# Altium schematic sheet Sheet1.SchDoc
size A4
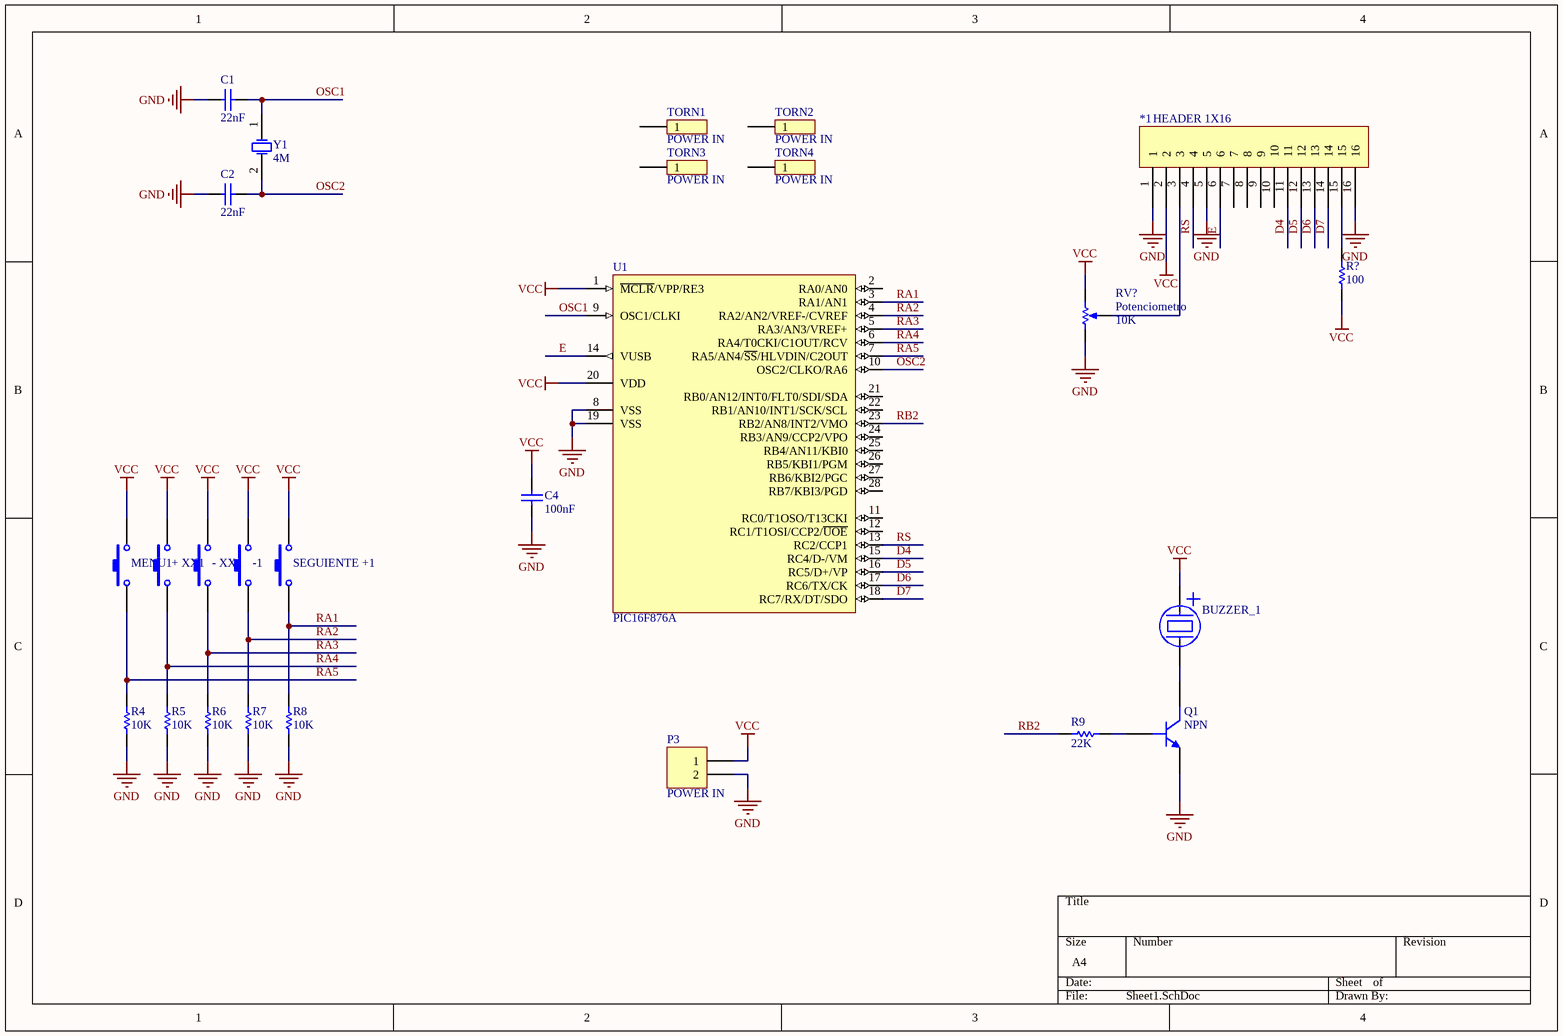
[diagram p0: Sheet1.SchDoc]

## Parts
*1  HEADER 1X16  [DISPLAY LCD 16x2]
+_XX1  PULSADOR  [PULSADOR4_ALTO]  (value not drawn)
-1  PULSADOR  [PULSADOR4_ALTO]  (value not drawn)
-_XX1  PULSADOR  [PULSADOR4_ALTO]  (value not drawn)
?  BUZZER_1  [Buzzer]
C1  value 22nF  [1206_Cap]  (hidden comment: Comment)
C2  value 22nF  [1206_Cap]  (hidden comment: Comment)
C4  value 100nF  [1206_Cap]  (hidden comment: Comment)
MENU1  PULSADOR  [PULSADOR4_ALTO]  (value not drawn)
P3  POWER IN  [BORNERA2 azul]
Q1  NPN  [TO92]
R4  value 10K  [1206]  (hidden comment: Comment)
R5  value 10K  [1206]  (hidden comment: Comment)
R6  value 10K  [1206]  (hidden comment: Comment)
R7  value 10K  [1206]  (hidden comment: Comment)
R8  value 10K  [1206]  (hidden comment: Comment)
R9  value 22K  [1206]  (hidden comment: Comment)
R?  value 100  [1206]  (hidden comment: Comment)
RV?  Potenciometro  value 10K  [PRESET VERTICAL]
SEGUIENTE_+1  PULSADOR  [PULSADOR4_ALTO]  (value not drawn)
TORN1  POWER IN  [TORNILLO]
TORN2  POWER IN  [TORNILLO]
TORN3  POWER IN  [TORNILLO]
TORN4  POWER IN  [TORNILLO]
U1  PIC16F876A  [DIP28]
Y1  4M  [CRISTAL]

## Nets
GND: *1.1 *1.5 *1.16 C1.1 C2.1 C4.1 P3.2 Q1.1(E) R4.2 R5.2 R6.2 R7.2 R8.2 RV?.1(TOP) U1.8(VSS) U1.19(VSS)
VCC: *1.2 +_XX1.2 -1.2 -_XX1.2 ?.1 C4.2 MENU1.2 P3.1 R?.2 RV?.2(BOT) SEGUIENTE_+1.2 U1.1(~{MCLR}/VPP/RE3) U1.20(VDD)
D4: *1.11 U1.15(RC4/D-/VM)
D5: *1.12 U1.16(RC5/D+/VP)
D6: *1.13 U1.17(RC6/TX/CK)
D7: *1.14 U1.18(RC7/RX/DT/SDO)
E: *1.6 U1.14(VUSB)
OSC1: C1.2 U1.9(OSC1/CLKI) Y1.1(OSC1)
OSC2: C2.2 U1.10(OSC2/CLKO/RA6) Y1.2(OSC2)
RA1: R8.1 SEGUIENTE_+1.1 U1.3(RA1/AN1)
RA2: -1.1 R7.1 U1.4(RA2/AN2/VREF-/CVREF)
RA3: -_XX1.1 R6.1 U1.5(RA3/AN3/VREF+)
RA4: +_XX1.1 R5.1 U1.6(RA4/T0CKI/C1OUT/RCV)
RA5: MENU1.1 R4.1 U1.7(RA5/AN4/~{SS}/HLVDIN/C2OUT)
RB2: R9.1 U1.23(RB2/AN8/INT2/VMO)
RS: *1.4 U1.13(RC2/CCP1)
Net*1_3: *1.3 RV?.3(TAP)
Net*1_15: *1.15 R?.1
Net?_2: ?.2 Q1.3(C)
NetQ1_2: Q1.2(B) R9.2

Not connected (* = marked no-connect by the designer): *1 7 8 9 10; TORN1 1; TORN2 1; TORN3 1; TORN4 1; U1 2(RA0/AN0) 11(RC0/T1OSO/T13CKI) 12(RC1/T1OSI/CCP2/~{UOE}) 21(RB0/AN12/INT0/FLT0/SDI/SDA) 22(RB1/AN10/INT1/SCK/SCL) 24(RB3/AN9/CCP2/VPO) 25(RB4/AN11/KBI0) 26(RB5/KBI1/PGM) 27(RB6/KBI2/PGC) 28(RB7/KBI3/PGD)

## Library data of the parts
+_XX1 -1 -_XX1 MENU1 SEGUIENTE_+1 = PULSADOR: Switch; Published: 24-Mar-1999; LatestRevisionDate: 17-Jul-2002; LatestRevisionNote: Re-released for DXP Platform.; PackageReference: SPST-2; Publisher: Altium Limited
C1 C2 C4 = Cap Semi: Capacitor (Semiconductor SIM Model); Published: 8-Jun-2000; LatestRevisionDate: 17-Jul-2002; LatestRevisionNote: Re-released for DXP Platform.; PackageReference: C1206; Publisher: Altium Limited
P3 = Header 2: Header, 2-Pin; LatestRevisionDate: 17-Jul-2002; LatestRevisionNote: Re-released for DXP Platform.; Publisher: Altium Limited
Q1 = NPN: PNP Bipolar Transistor; Published: 8-Jun-2000; LatestRevisionDate: 17-Jul-2002; LatestRevisionNote: Re-released for DXP Platform.; PackageReference: SOT-23B; Publisher: Altium Limited; Code_JEDEC: SOT-23
R4-R9 R? = Res Semi: Semiconductor Resistor; Published: 8-Jun-2000; LatestRevisionDate: 17-Jul-2002; LatestRevisionNote: Re-released for DXP Platform.; PackageReference: AXIAL-0.5; Publisher: Altium Limited
RV? = Potenciometro: Potentiometer; Sim Note: Enter the Resistance value and the set point into parameter fields.; Set Position: 0.5; Published: 8-Jun-2000; LatestRevisionDate: 17-Jul-2002; LatestRevisionNote: Re-released for DXP Platform.; PackageReference: VR5; Publisher: Altium Limited
TORN1-TORN4 = Header 1: Header, 2-Pin; LatestRevisionDate: 17-Jul-2002; LatestRevisionNote: Re-released for DXP Platform.; Publisher: Altium Limited
Y1 = XTAL: Crystal Oscillator; Published: 8-Jun-2000; LatestRevisionDate: 17-Jul-2002; LatestRevisionNote: Re-released for DXP Platform.; PackageReference: R38; Publisher: Altium Limited
U1 = PIC16F876A: FirstPublished: 29-Jan-2009; LatestRevisionDate: 02-Dec-2009; LatestRevisionNote: Updated to datasheet revision E, Aug-2008; DatasheetVersion: revE, Aug-2008; PackageVersion: revBB, Aug-2009; PackageReference: SPDIP300-SP28; Publisher: Altium Limited; PackageDescription: 28-Lead Skinny Plastic Dual In-Line (SP) - 300 mil Body [SPDIP]; Supplier 1: Digi-Key; Supplier Part Number 1: PIC18F2550-I/SP-ND; Supplier 2: Farnell; Supplier Part Number 2: 1523822; Supplier 3: Farnell; Supplier Part Number 3: 9321250; Supplier 4: Newark; Supplier Part Number 4: 80K6054; ComponentLink1Description: Datasheet; ComponentLink1URL: http://ww1.microchip.com/downloads/en/DeviceDoc/39632e.pdf; ComponentLink2Description: Packaging Specification; ComponentLink2URL: http://www.microchip.com/stellent/groups/techpub_sg/documents/packagingspec/en012702.pdf; ComponentLink3Description: Microchip.com Home; ComponentLink3URL: http://www.microchip.com/